# Altium project PLIS_EPM240T100C5N.PrjPcb
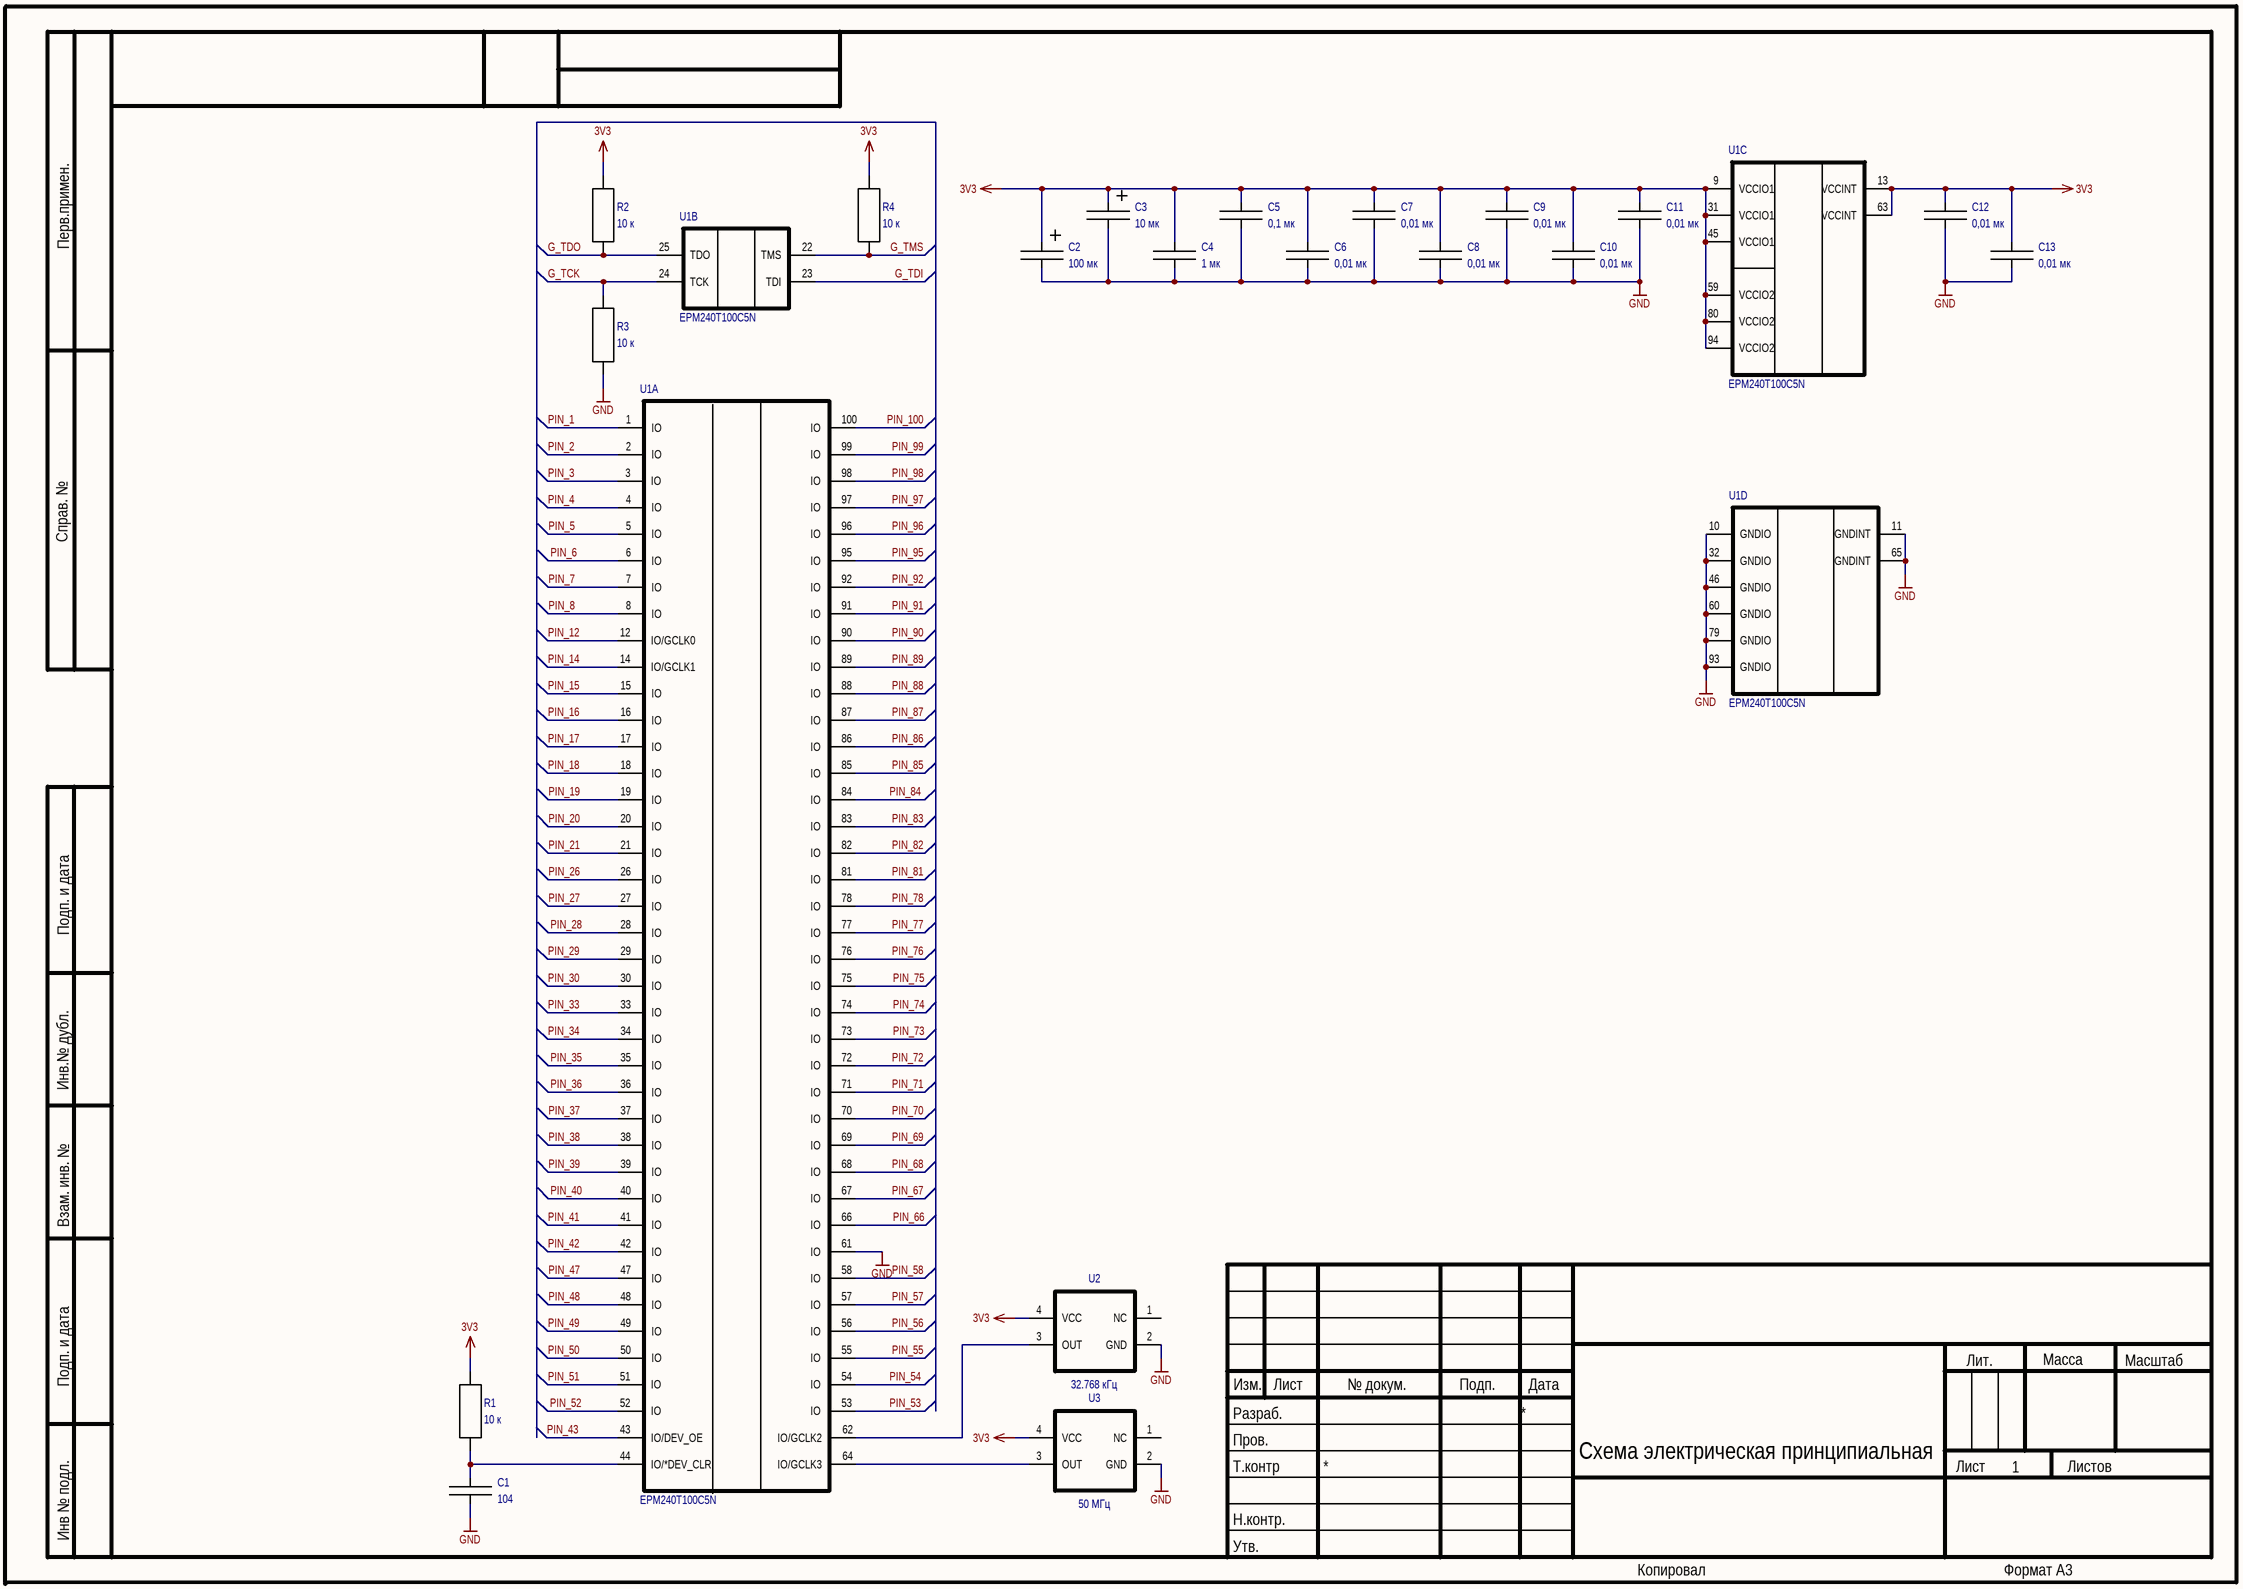
[diagram p0: EPM240T100C5N.SchDoc]
2 sheets, 21 parts. Net scope: global (net labels, ports and power ports of the same name join across sheets).
Board file: PLIS_EPM240T100C5N.PcbDoc
Sheets:
  EPM240T100C5N.SchDoc
  EPM240T100C5N_2.SchDoc

## Sheet EPM240T100C5N.SchDoc
size 420 x 297 mm; SheetNumber: 1; SheetTotal: 2

### Parts
C1  value 104  [K10-79_1.6_0.8(0603)]  (hidden comment: 0603)
C2  value 100 мк  [K53-68_3216(A)]  (hidden comment: A-case)
C3  value 10 мк  [K53-68_3216(A)]  (hidden comment: A-case)
C4  value 1 мк  [K10-79_2.0_1.25(0805)]  (hidden comment: 0603)
C5  value 0,1 мк  [K10-79_1.6_0.8(0603)]  (hidden comment: 0603)
C6  value 0,01 мк  [K10-79_1.6_0.8(0603)]  (hidden comment: 0603)
C7  value 0,01 мк  [K10-79_1.6_0.8(0603)]  (hidden comment: 0603)
C8  value 0,01 мк  [K10-79_1.6_0.8(0603)]  (hidden comment: 0603)
C9  value 0,01 мк  [K10-79_1.6_0.8(0603)]  (hidden comment: 0603)
C10  value 0,01 мк  [K10-79_1.6_0.8(0603)]  (hidden comment: 0603)
C11  value 0,01 мк  [K10-79_1.6_0.8(0603)]  (hidden comment: 0603)
C12  value 0,01 мк  [K10-79_1.6_0.8(0603)]  (hidden comment: 0603)
C13  value 0,01 мк  [K10-79_1.6_0.8(0603)]  (hidden comment: 0603)
R1  value 10 к  [RES 0603]
R2  value 10 к  [RES 0603]
R3  value 10 к  [RES 0603]
R4  value 10 к  [RES 0603]
U1  EPM240T100C5N  [100-TQFP_ALR]  (parts A,B,C,D of 4)
U2  value 32.768 кГц  [CB3LV3C50M0000]  (hidden comment: генератор)
U3  value 50 МГц  [CB3LV3C50M0000]  (hidden comment: генератор)

### Nets
3V3: C2.1 C3.1 C4.2 C5.2 C6.2 C7.2 C8.2 C9.2 C10.2 C11.2 C12.2 C13.2 R1.1 R2.1 R4.1 U1.9(VCCIO1) U1.13(VCCINT) U1.31(VCCIO1) U1.45(VCCIO1) U1.59(VCCIO2) U1.63(VCCINT) U1.80(VCCIO2) U1.94(VCCIO2) U2.4(VCC) U3.4(VCC)
GND: C1.1 C2.2 C3.2 C4.1 C5.1 C6.1 C7.1 C8.1 C9.1 C10.1 C11.1 C12.1 C13.1 R3.2 U1.10(GNDIO) U1.11(GNDINT) U1.32(GNDIO) U1.46(GNDIO) U1.60(GNDIO) U1.61(IO) U1.65(GNDINT) U1.79(GNDIO) U1.93(GNDIO) U2.2(GND) U3.2(GND)
G_TCK: R3.1 U1.24(TCK)
G_TDI: U1.23(TDI)
G_TDO: R2.2 U1.25(TDO)
G_TMS: R4.2 U1.22(TMS)
PIN_1: U1.1(IO)
PIN_2: U1.2(IO)
PIN_3: U1.3(IO)
PIN_4: U1.4(IO)
PIN_5: U1.5(IO)
PIN_6: U1.6(IO)
PIN_7: U1.7(IO)
PIN_8: U1.8(IO)
PIN_12: U1.12(IO/GCLK0)
PIN_14: U1.14(IO/GCLK1)
PIN_15: U1.15(IO)
PIN_16: U1.16(IO)
PIN_17: U1.17(IO)
PIN_18: U1.18(IO)
PIN_19: U1.19(IO)
PIN_20: U1.20(IO)
PIN_21: U1.21(IO)
PIN_26: U1.26(IO)
PIN_27: U1.27(IO)
PIN_28: U1.28(IO)
PIN_29: U1.29(IO)
PIN_30: U1.30(IO)
PIN_33: U1.33(IO)
PIN_34: U1.34(IO)
PIN_35: U1.35(IO)
PIN_36: U1.36(IO)
PIN_37: U1.37(IO)
PIN_38: U1.38(IO)
PIN_39: U1.39(IO)
PIN_40: U1.40(IO)
PIN_41: U1.41(IO)
PIN_42: U1.42(IO)
PIN_43: U1.43(IO/DEV_OE)
PIN_47: U1.47(IO)
PIN_48: U1.48(IO)
PIN_49: U1.49(IO)
PIN_50: U1.50(IO)
PIN_51: U1.51(IO)
PIN_52: U1.52(IO)
PIN_53: U1.53(IO)
PIN_54: U1.54(IO)
PIN_55: U1.55(IO)
PIN_56: U1.56(IO)
PIN_57: U1.57(IO)
PIN_58: U1.58(IO)
PIN_66: U1.66(IO)
PIN_67: U1.67(IO)
PIN_68: U1.68(IO)
PIN_69: U1.69(IO)
PIN_70: U1.70(IO)
PIN_71: U1.71(IO)
PIN_72: U1.72(IO)
PIN_73: U1.73(IO)
PIN_74: U1.74(IO)
PIN_75: U1.75(IO)
PIN_76: U1.76(IO)
PIN_77: U1.77(IO)
PIN_78: U1.78(IO)
PIN_81: U1.81(IO)
PIN_82: U1.82(IO)
PIN_83: U1.83(IO)
PIN_84: U1.84(IO)
PIN_85: U1.85(IO)
PIN_86: U1.86(IO)
PIN_87: U1.87(IO)
PIN_88: U1.88(IO)
PIN_89: U1.89(IO)
PIN_90: U1.90(IO)
PIN_91: U1.91(IO)
PIN_92: U1.92(IO)
PIN_95: U1.95(IO)
PIN_96: U1.96(IO)
PIN_97: U1.97(IO)
PIN_98: U1.98(IO)
PIN_99: U1.99(IO)
PIN_100: U1.100(IO)
NetC1_2: C1.2 R1.2 U1.44(IO/*DEV_CLR)
NetU1_62: U1.62(IO/GCLK2) U2.3(OUT)
NetU1_64: U1.64(IO/GCLK3) U3.3(OUT)

Not connected (* = marked no-connect by the designer): U2 1(NC); U3 1(NC)

### Notes on the sheet
- Перв.примен.
- Справ. №
- Подп. и дата
- Инв.№ дубл.
- Взам. инв. №
- Изм.
- Лист
- № докум.
- Подп.
- Дата
- Лит.
- Масса
- Масштаб
- Пров.
- Т.контр
- Разраб.
- Схема электрическая принципиальная
- 1
- Листов
- Инв № подл.
- Н.контр.
- Утв.
- Копировал
- Формат А3

### Library data of the parts
C1 C4-C13 = C: Company: *; PartNumber: *; Tolerance: *; Voltage: *; Type: *; Package: 0603
C2 C3 = C+: Company: *; Tolerance: *; Voltage: *; Type: *; PartNumber: *; Package: A-case
R1-R4 = R_1: Company: *; PartNumber: *; Package: *; Tolerance: *
U2 U3 = генератор: PartNumber: MQ-12.000-18; Company: Mercury; Package: 0705

## Sheet EPM240T100C5N_2.SchDoc
size 420 x 297 mm; SheetNumber: 2; SheetTotal: 2
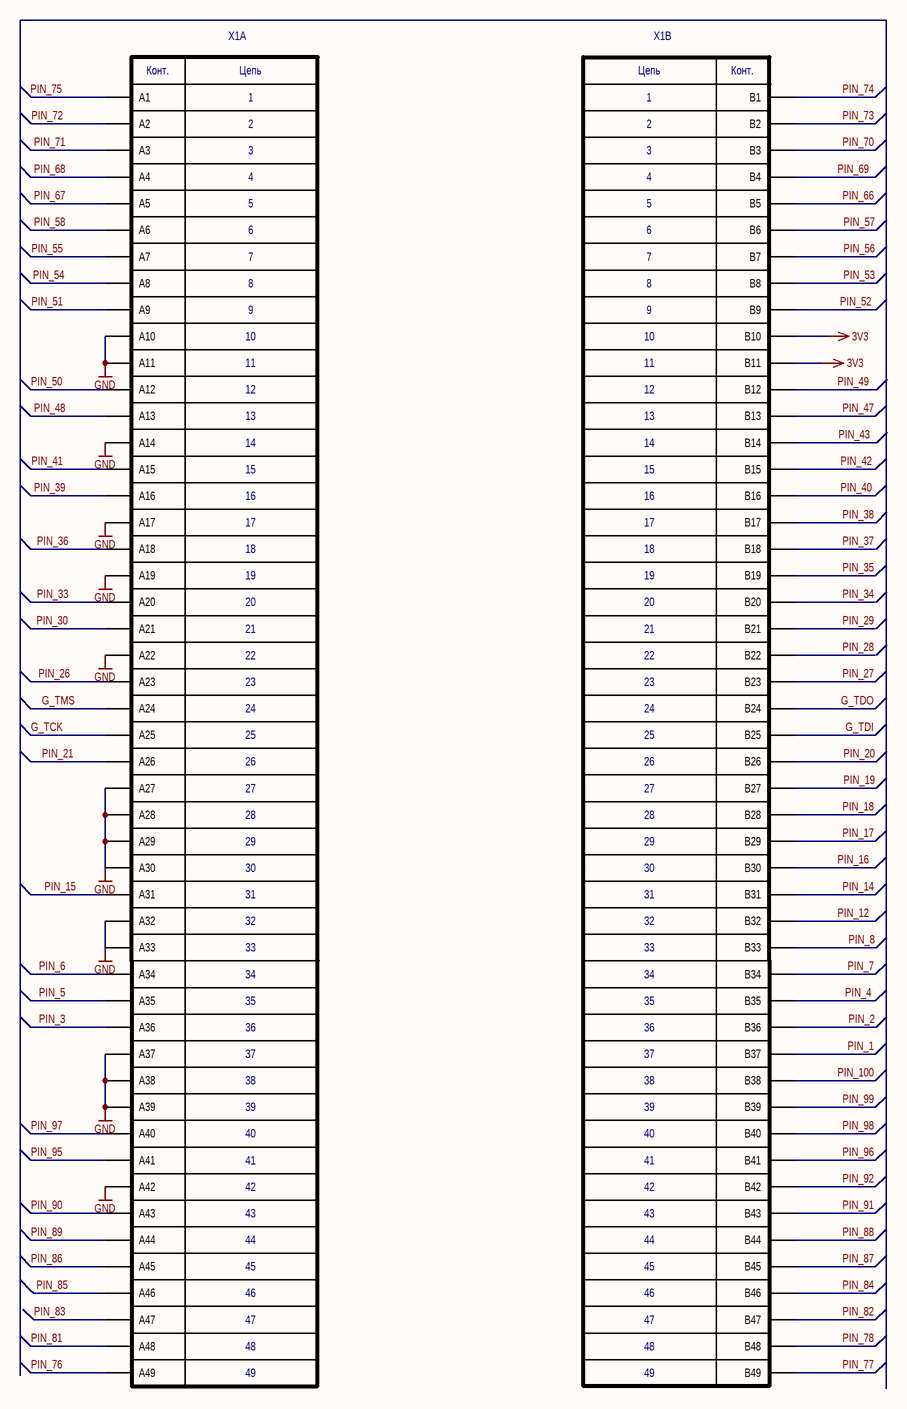
[diagram p1: EPM240T100C5N_2.SchDoc]

### Parts
X1  KONT_POLE_MEZ  [3113-112t_otv]  (value not drawn)  (parts A,B of 2)

### Nets
3V3: X1.B10 X1.B11
GND: X1.A10 X1.A11 X1.A14 X1.A17 X1.A19 X1.A22 X1.A27 X1.A28 X1.A29 X1.A30 X1.A32 X1.A33 X1.A37 X1.A38 X1.A39 X1.A42
G_TCK: X1.A25
G_TDI: X1.B25
G_TDO: X1.B24
G_TMS: X1.A24
PIN_1: X1.B37
PIN_2: X1.B36
PIN_3: X1.A36
PIN_4: X1.B35
PIN_5: X1.A35
PIN_6: X1.A34
PIN_7: X1.B34
PIN_8: X1.B33
PIN_12: X1.B32
PIN_14: X1.B31
PIN_15: X1.A31
PIN_16: X1.B30
PIN_17: X1.B29
PIN_18: X1.B28
PIN_19: X1.B27
PIN_20: X1.B26
PIN_21: X1.A26
PIN_26: X1.A23
PIN_27: X1.B23
PIN_28: X1.B22
PIN_29: X1.B21
PIN_30: X1.A21
PIN_33: X1.A20
PIN_34: X1.B20
PIN_35: X1.B19
PIN_36: X1.A18
PIN_37: X1.B18
PIN_38: X1.B17
PIN_39: X1.A16
PIN_40: X1.B16
PIN_41: X1.A15
PIN_42: X1.B15
PIN_43: X1.B14
PIN_47: X1.B13
PIN_48: X1.A13
PIN_49: X1.B12
PIN_50: X1.A12
PIN_51: X1.A9
PIN_52: X1.B9
PIN_53: X1.B8
PIN_54: X1.A8
PIN_55: X1.A7
PIN_56: X1.B7
PIN_57: X1.B6
PIN_58: X1.A6
PIN_66: X1.B5
PIN_67: X1.A5
PIN_68: X1.A4
PIN_69: X1.B4
PIN_70: X1.B3
PIN_71: X1.A3
PIN_72: X1.A2
PIN_73: X1.B2
PIN_74: X1.B1
PIN_75: X1.A1
PIN_76: X1.A49
PIN_77: X1.B49
PIN_78: X1.B48
PIN_81: X1.A48
PIN_82: X1.B47
PIN_83: X1.A47
PIN_84: X1.B46
PIN_85: X1.A46
PIN_86: X1.A45
PIN_87: X1.B45
PIN_88: X1.B44
PIN_89: X1.A44
PIN_90: X1.A43
PIN_91: X1.B43
PIN_92: X1.B42
PIN_95: X1.A41
PIN_96: X1.B41
PIN_97: X1.A40
PIN_98: X1.B40
PIN_99: X1.B39
PIN_100: X1.B38

### Notes on the sheet
- Подп. и дата
- Инв.№ дубл.
- Взам. инв. №
- Инв № подл.
- Изм.
- Лист
- № докум.
- Подп.
- Дата
- Копировал
- Формат А3
- (in symbol 3113-112T, part A) Конт.; Цепь; 1; 2; 3; 4; 5; 6; 7; 8; 9; 10; 11; 12; 13; 14; 15; 16; 17; 18; 19; 20; 21; 22; 23; 24; 25; 26; 27; 28; 29; 30; 31; 32; 33; 34; 35; 36; 37; 38; 39; 40; 41; 42; 43; 44; 45; 46; 47; 48; 49
- (in symbol 3113-112T, part B) Цепь; Конт.; 1; 2; 3; 4; 5; 6; 7; 8; 9; 10; 11; 12; 13; 14; 15; 16; 17; 18; 19; 20; 21; 22; 23; 24; 25; 26; 27; 28; 29; 30; 31; 32; 33; 34; 35; 36; 37; 38; 39; 40; 41; 42; 43; 44; 45; 46; 47; 48; 49

### Library data of the parts
X1 = 3113-112T

## Nets that join several sheets
3V3: EPM240T100C5N (25 pins), EPM240T100C5N_2 (X1.B10 X1.B11)
GND: EPM240T100C5N (25 pins), EPM240T100C5N_2 (16 pins)
G_TCK: EPM240T100C5N (R3.1 U1.24), EPM240T100C5N_2 (X1.A25)
G_TDI: EPM240T100C5N (U1.23), EPM240T100C5N_2 (X1.B25)
G_TDO: EPM240T100C5N (R2.2 U1.25), EPM240T100C5N_2 (X1.B24)
G_TMS: EPM240T100C5N (R4.2 U1.22), EPM240T100C5N_2 (X1.A24)
PIN_1: EPM240T100C5N (U1.1), EPM240T100C5N_2 (X1.B37)
PIN_2: EPM240T100C5N (U1.2), EPM240T100C5N_2 (X1.B36)
PIN_3: EPM240T100C5N (U1.3), EPM240T100C5N_2 (X1.A36)
PIN_4: EPM240T100C5N (U1.4), EPM240T100C5N_2 (X1.B35)
PIN_5: EPM240T100C5N (U1.5), EPM240T100C5N_2 (X1.A35)
PIN_6: EPM240T100C5N (U1.6), EPM240T100C5N_2 (X1.A34)
PIN_7: EPM240T100C5N (U1.7), EPM240T100C5N_2 (X1.B34)
PIN_8: EPM240T100C5N (U1.8), EPM240T100C5N_2 (X1.B33)
PIN_12: EPM240T100C5N (U1.12), EPM240T100C5N_2 (X1.B32)
PIN_14: EPM240T100C5N (U1.14), EPM240T100C5N_2 (X1.B31)
PIN_15: EPM240T100C5N (U1.15), EPM240T100C5N_2 (X1.A31)
PIN_16: EPM240T100C5N (U1.16), EPM240T100C5N_2 (X1.B30)
PIN_17: EPM240T100C5N (U1.17), EPM240T100C5N_2 (X1.B29)
PIN_18: EPM240T100C5N (U1.18), EPM240T100C5N_2 (X1.B28)
PIN_19: EPM240T100C5N (U1.19), EPM240T100C5N_2 (X1.B27)
PIN_20: EPM240T100C5N (U1.20), EPM240T100C5N_2 (X1.B26)
PIN_21: EPM240T100C5N (U1.21), EPM240T100C5N_2 (X1.A26)
PIN_26: EPM240T100C5N (U1.26), EPM240T100C5N_2 (X1.A23)
PIN_27: EPM240T100C5N (U1.27), EPM240T100C5N_2 (X1.B23)
PIN_28: EPM240T100C5N (U1.28), EPM240T100C5N_2 (X1.B22)
PIN_29: EPM240T100C5N (U1.29), EPM240T100C5N_2 (X1.B21)
PIN_30: EPM240T100C5N (U1.30), EPM240T100C5N_2 (X1.A21)
PIN_33: EPM240T100C5N (U1.33), EPM240T100C5N_2 (X1.A20)
PIN_34: EPM240T100C5N (U1.34), EPM240T100C5N_2 (X1.B20)
PIN_35: EPM240T100C5N (U1.35), EPM240T100C5N_2 (X1.B19)
PIN_36: EPM240T100C5N (U1.36), EPM240T100C5N_2 (X1.A18)
PIN_37: EPM240T100C5N (U1.37), EPM240T100C5N_2 (X1.B18)
PIN_38: EPM240T100C5N (U1.38), EPM240T100C5N_2 (X1.B17)
PIN_39: EPM240T100C5N (U1.39), EPM240T100C5N_2 (X1.A16)
PIN_40: EPM240T100C5N (U1.40), EPM240T100C5N_2 (X1.B16)
PIN_41: EPM240T100C5N (U1.41), EPM240T100C5N_2 (X1.A15)
PIN_42: EPM240T100C5N (U1.42), EPM240T100C5N_2 (X1.B15)
PIN_43: EPM240T100C5N (U1.43), EPM240T100C5N_2 (X1.B14)
PIN_47: EPM240T100C5N (U1.47), EPM240T100C5N_2 (X1.B13)
PIN_48: EPM240T100C5N (U1.48), EPM240T100C5N_2 (X1.A13)
PIN_49: EPM240T100C5N (U1.49), EPM240T100C5N_2 (X1.B12)
PIN_50: EPM240T100C5N (U1.50), EPM240T100C5N_2 (X1.A12)
PIN_51: EPM240T100C5N (U1.51), EPM240T100C5N_2 (X1.A9)
PIN_52: EPM240T100C5N (U1.52), EPM240T100C5N_2 (X1.B9)
PIN_53: EPM240T100C5N (U1.53), EPM240T100C5N_2 (X1.B8)
PIN_54: EPM240T100C5N (U1.54), EPM240T100C5N_2 (X1.A8)
PIN_55: EPM240T100C5N (U1.55), EPM240T100C5N_2 (X1.A7)
PIN_56: EPM240T100C5N (U1.56), EPM240T100C5N_2 (X1.B7)
PIN_57: EPM240T100C5N (U1.57), EPM240T100C5N_2 (X1.B6)
PIN_58: EPM240T100C5N (U1.58), EPM240T100C5N_2 (X1.A6)
PIN_66: EPM240T100C5N (U1.66), EPM240T100C5N_2 (X1.B5)
PIN_67: EPM240T100C5N (U1.67), EPM240T100C5N_2 (X1.A5)
PIN_68: EPM240T100C5N (U1.68), EPM240T100C5N_2 (X1.A4)
PIN_69: EPM240T100C5N (U1.69), EPM240T100C5N_2 (X1.B4)
PIN_70: EPM240T100C5N (U1.70), EPM240T100C5N_2 (X1.B3)
PIN_71: EPM240T100C5N (U1.71), EPM240T100C5N_2 (X1.A3)
PIN_72: EPM240T100C5N (U1.72), EPM240T100C5N_2 (X1.A2)
PIN_73: EPM240T100C5N (U1.73), EPM240T100C5N_2 (X1.B2)
PIN_74: EPM240T100C5N (U1.74), EPM240T100C5N_2 (X1.B1)
PIN_75: EPM240T100C5N (U1.75), EPM240T100C5N_2 (X1.A1)
PIN_76: EPM240T100C5N (U1.76), EPM240T100C5N_2 (X1.A49)
PIN_77: EPM240T100C5N (U1.77), EPM240T100C5N_2 (X1.B49)
PIN_78: EPM240T100C5N (U1.78), EPM240T100C5N_2 (X1.B48)
PIN_81: EPM240T100C5N (U1.81), EPM240T100C5N_2 (X1.A48)
PIN_82: EPM240T100C5N (U1.82), EPM240T100C5N_2 (X1.B47)
PIN_83: EPM240T100C5N (U1.83), EPM240T100C5N_2 (X1.A47)
PIN_84: EPM240T100C5N (U1.84), EPM240T100C5N_2 (X1.B46)
PIN_85: EPM240T100C5N (U1.85), EPM240T100C5N_2 (X1.A46)
PIN_86: EPM240T100C5N (U1.86), EPM240T100C5N_2 (X1.A45)
PIN_87: EPM240T100C5N (U1.87), EPM240T100C5N_2 (X1.B45)
PIN_88: EPM240T100C5N (U1.88), EPM240T100C5N_2 (X1.B44)
PIN_89: EPM240T100C5N (U1.89), EPM240T100C5N_2 (X1.A44)
PIN_90: EPM240T100C5N (U1.90), EPM240T100C5N_2 (X1.A43)
PIN_91: EPM240T100C5N (U1.91), EPM240T100C5N_2 (X1.B43)
PIN_92: EPM240T100C5N (U1.92), EPM240T100C5N_2 (X1.B42)
PIN_95: EPM240T100C5N (U1.95), EPM240T100C5N_2 (X1.A41)
PIN_96: EPM240T100C5N (U1.96), EPM240T100C5N_2 (X1.B41)
PIN_97: EPM240T100C5N (U1.97), EPM240T100C5N_2 (X1.A40)
PIN_98: EPM240T100C5N (U1.98), EPM240T100C5N_2 (X1.B40)
PIN_99: EPM240T100C5N (U1.99), EPM240T100C5N_2 (X1.B39)
PIN_100: EPM240T100C5N (U1.100), EPM240T100C5N_2 (X1.B38)